# Altium schematic sheet ACT01_RS232 V3.0.SchDoc
size A4; DocumentNumber: 6; SheetNumber: 6; SheetTotal: 6
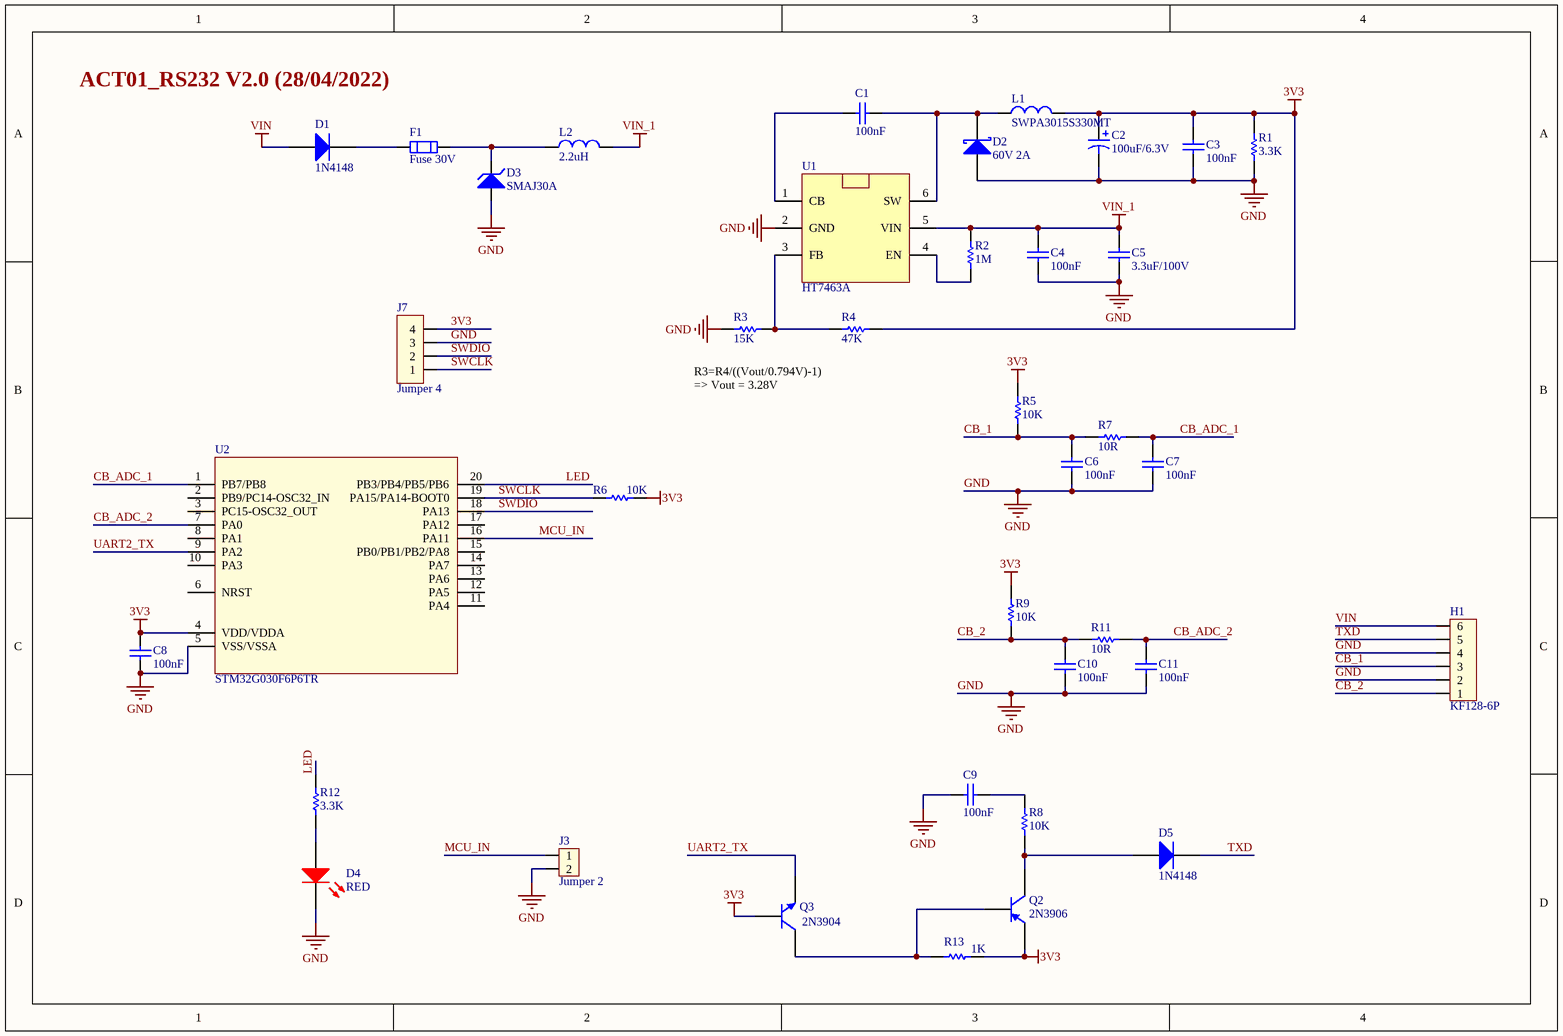
[diagram p0: ACT01_RS232 V3.0.SchDoc]

## Parts
C1  100nF  [0603 - C]
C2  value 100uF/6.3V  [3528 - TANTALUM]  (hidden comment: 107B)
C3  100nF  [0603 - C]
C4  100nF  [0603 - C]
C5  3.3uF/100V  [1210 - C]
C6  100nF  [0603 - C]
C7  100nF  [0603 - C]
C8  100nF  [0603 - C]
C9  100nF  [0603 - C]
C10  100nF  [0603 - C]
C11  100nF  [0603 - C]
D1  1N4148  [SOD-123]
D2  60V 2A  [SOD-123]
D3  SMAJ30A  [Diode - SMA]
D4  RED  [LED - 0603 - R]
D5  1N4148  [SOD-123]
F1  Fuse 30V  [1206 - Fuse]
H1  KF128-6P  [KF128 - 6P]
J3  Jumper 2  [JP2]
J7  Jumper 4  [JP4 2mm]
L1  SWPA3015S330MT  [IND_3x3]
L2  2.2uH  [1210 - L]
Q2  2N3906  [SOT23B]
Q3  2N3904  [SOT23B]
R1  3.3K  [0603 - R]
R2  1M  [0603 - R]
R3  15K  [0603 - R]
R4  47K  [0603 - R]
R5  10K  [0603 - R]
R6  10K  [0603 - R]
R7  10R  [0603 - R]
R8  10K  [0603 - R]
R9  10K  [0603 - R]
R11  10R  [0603 - R]
R12  3.3K  [0603 - R]
R13  1K  [0603 - R]
U1  HT7463A  [SOT23-6_L]
U2  STM32G030F6P6TR  [TSSOP20]

## Nets
3V3: C2.1 C3.2 C8.2 J7.4 L1.2 Q2.2(E) Q3.1(B) R1.2 R4.2 R5.2 R6.2 R9.2 R13.2 U2.4(VDD/VDDA)
GND: C2.2 C3.1 C4.1 C5.1 C6.1 C7.1 C8.1 C9.1 C10.1 C11.1 D2.1(A) D3.1(A) D4.2(K) H1.2 H1.4 J3.2 J7.3 R1.1 R3.2 U1.2(GND) U2.5(VSS/VSSA)
VIN: D1.1(A) H1.6
VIN_1: C4.2 C5.2 L2.2 R2.2 U1.5(VIN)
CB_1: C6.2 H1.3 R5.1 R7.1
CB_2: C10.2 H1.1 R9.1 R11.1
CB_ADC_1: C7.2 R7.2 U2.1(PB7/PB8)
CB_ADC_2: C11.2 R11.2 U2.7(PA0)
LED: R12.2 U2.20(PB3/PB4/PB5/PB6)
MCU_IN: J3.1 U2.16(PA11)
SWCLK: J7.1 R6.1 U2.19(PA15/PA14-BOOT0)
SWDIO: J7.2 U2.18(PA13)
TXD: D5.2(K) H1.5
UART2_TX: Q3.2(E) U2.9(PA2)
NetC1_1: C1.1 U1.1(CB)
NetC1_2: C1.2 D2.2(K) L1.1 U1.6(SW)
NetC9_2: C9.2 R8.1
NetD1_2: D1.2(K) F1.1
NetD3_2: D3.2(K) F1.2 L2.1
NetD4_1: D4.1(A) R12.1
NetD5_1: D5.1(A) Q2.3(C) R8.2
NetQ2_1: Q2.1(B) Q3.3(C) R13.1
NetR2_1: R2.1 U1.4(EN)
NetR3_1: R3.1 R4.1 U1.3(FB)

Not connected (* = marked no-connect by the designer): U2 2(PB9/PC14-OSC32_IN) 3(PC15-OSC32_OUT) 6(NRST) 8(PA1) 10(PA3) 11(PA4) 12(PA5) 13(PA6) 14(PA7) 15(PB0/PB1/PB2/PA8) 17(PA12)

## Notes on the sheet
- ACT01_RS232 V2.0 (28/04/2022)
- R3=R4/((Vout/0.794V)-1)
  => Vout = 3.28V

## Library data of the parts
C1 C3 C4 C6 C7 C10 C11 = Cap 0603 100nF: CAP CER 100nF 50V C0G/NP0 0603; MPN: CL10C104JB8NNNC; MFR: SAMSUNG; Company ID: VT_TỤ ĐIỆN_C0603 100nF; Voltage: 50V; Package: 0603; Size: C0603: 100nF; Value: 100nF
C2 = Cap Tan 3528 100uF/6.3V: CAP TANT 100UF 6.3V 10% 1411; MPN: T491B107K006AT; MFR: Kemet; Company ID: VT_CAP TAN 100uF 6.3V
C5 = Cap 1210 3.3uF: CAP CER 3.3UF 100V X7S 1210; MPN: C3225X7S2A335M200AB; MFR: TDK Corporation; Company ID: VT_CAP_C1210 3.3uF 100V; Size: C1210: 3.3uF/100V; MPN2: 885012209071; Value: 3.3uF/100V
C8 C9 = Cap 0603 100nF: CAP CER 100nF 50V C0G/NP0 0603; MPN: CL10C104JB8NNNC; MFR: SAMSUNG; Company ID: VT_CAP_C0603 100nF; Voltage: 50V; Package: 0603; Size: C0603: 100nF; Value: 100nF
D1 D5 = Diode 1N4148: DIODE GEN PURP 100V 300MA SOD123; MPN: 1N4148W-7-F; MFR: DIODES; Company ID: VT_DIODE_1N4148W-7-F
D2 = Diode PMEG6020ER: DIODE SCHOTTKY 60V 2A SOD123W; MPN: PMEG6020ER,115; MFR: NXP; Company ID: VT_DIODE_PMEG6020ER
D3 = Diode SMAJ30A: TVS DIODE 30V 48.4V DO214AC; MFR: Littelfuse Inc.; Company ID: VT_DIODE_ SMAJ30A; MPN: SMAJ30A
D4 = LED 0603 RED: LED RED CLEAR 0603 SMD; MFR: Everlight; MPN: QTLP601CRTR; Company ID: VT_LED_0603 RED; Size: LED 0603 - RED
F1 = Fuse 30V - 0.125A: PTC RESET FUSE 30V 0.125A 1206; MFR: BrightKing; MPN: SMD1206B012TF; Company ID: VT_Fuse_30V - 0.125A
H1 = HD KF128 6P: 6-Pin Plug-in Terminal Block Connector 5.08mm Pitch Through Hole; MFR: China; Company ID: VT_CONN_KF128 6P; MPN: KF128 - 6P
J3 = JP2: Jumper 2, 2.54mmx2
J7 = JP4: Jumper 4, 2.54mmx4
L1 = Inductor 33uH: FIXED IND 33UH 430MA 1.066OHM SM; MFR: Shenzhen Sunlord Electronics Co., Ltd.; Company ID: xx; MPN: SWPA3015S330MT
L2 = Inductor 3225 2.2uH: FIXED IND 2.2UH 1.6A 76 MOHM SMD; MPN: LQH32PN2R2NN0; MFR: Murata; Company ID: VT_IND_3225 2.2uH; Value: 2.2uH; Size: L3225: 2.2uH; MPN2: SWPA3015S2R2NT
Q2 = Transistor 2N3906: TRANS PNP 40V 0.2A SOT23; MPN: MMBT3906; MFR: Fairchild; Company ID: VT_TRANSISTOR_3906
Q3 = Transistor 2N3904: TRANS NPN 40V 0.2A SOT-23; MPN: MMBT3904; MFR: Fairchild; Company ID: VT_TRANSISTOR_3904
R1 R12 = Res 0603 3.3K: RES SMD 3.3K OHM 1% 1/10W 0603; MFR: Yageo; MPN: RC0603FR-073K3L; Company ID: VT_RES_R0603 3.3K; Size: R0603: 3.3K; Value: 3.3K
R2 = Res 0603 1M: RES SMD 1M OHM 1% 1/10W 0603; MFR: Yageo; MPN: RC0603FR-071ML; Company ID: VT_ĐIỆN TRỞ_R0603 1M; Value: 1M
R3 = Res 0603 15K: RES SMD 15K OHM 1% 1/10W 0603; MFR: Yageo; MPN: RC0603FR-0715KL; Company ID: VT_ĐIỆN TRỞ_R0603 15K; Size: R0603: 15K; Value: 15K
R4 = Res 0603 47K: RES SMD 47K OHM 1% 1/10W 0603; MFR: Yageo; MPN: RE0603FRE0747KL; Company ID: VT_RES_R0603 47K; Size: R0603: 47K; Value: 47K
R5 R8 R9 = Res 0603 10K: RES SMD 10K OHM 1% 1/10W 0603; MFR: Yageo; MPN: RC0603FR-0710KL; Company ID: VT_RES_R0603 10K; Size: R0603: 10K; Value: 10K
R6 = Res 0603 10K: RES SMD 10K OHM 1% 1/10W 0603; MFR: Yageo; MPN: RC0603FR-0710KL; Company ID: VT_ĐIỆN TRỞ_R0603 10K; Size: R0603: 10K; Value: 10K
R7 R11 = Res 0603 10R: RES SMD 10 OHM 1% 1/10W 0603; MFR: Yageo; MPN: RC0603FR-0710RL; Company ID: VT_RES_R0603 10R; Size: R0603: 10R; Value: 10R
R13 = Res 0603 1K: RES SMD 1K OHM 1% 1/10W 0603; MFR: Yageo; MPN: RC0603FR-071KL; Company ID: VT_ĐIỆN TRỞ_R0603 1K; Value: 1K; Size: R0603: 1K
U1 = HT7463A/HT7463B: 52V/600mA, 1.25MHz/550kHz / Asynchronous Step Down Converter; MFR: Holtek; Company ID: VT_IC_HT7463A; MPN: HT7463A
U2 = STM32G030F6P6TR: IC MCU 32BIT 32KB FLASH 20TSSOP; MPN: STMicroelectronics; Company ID: VT_IC_STM32G030F6P6TR; MFR: STM32G030F6P6TR